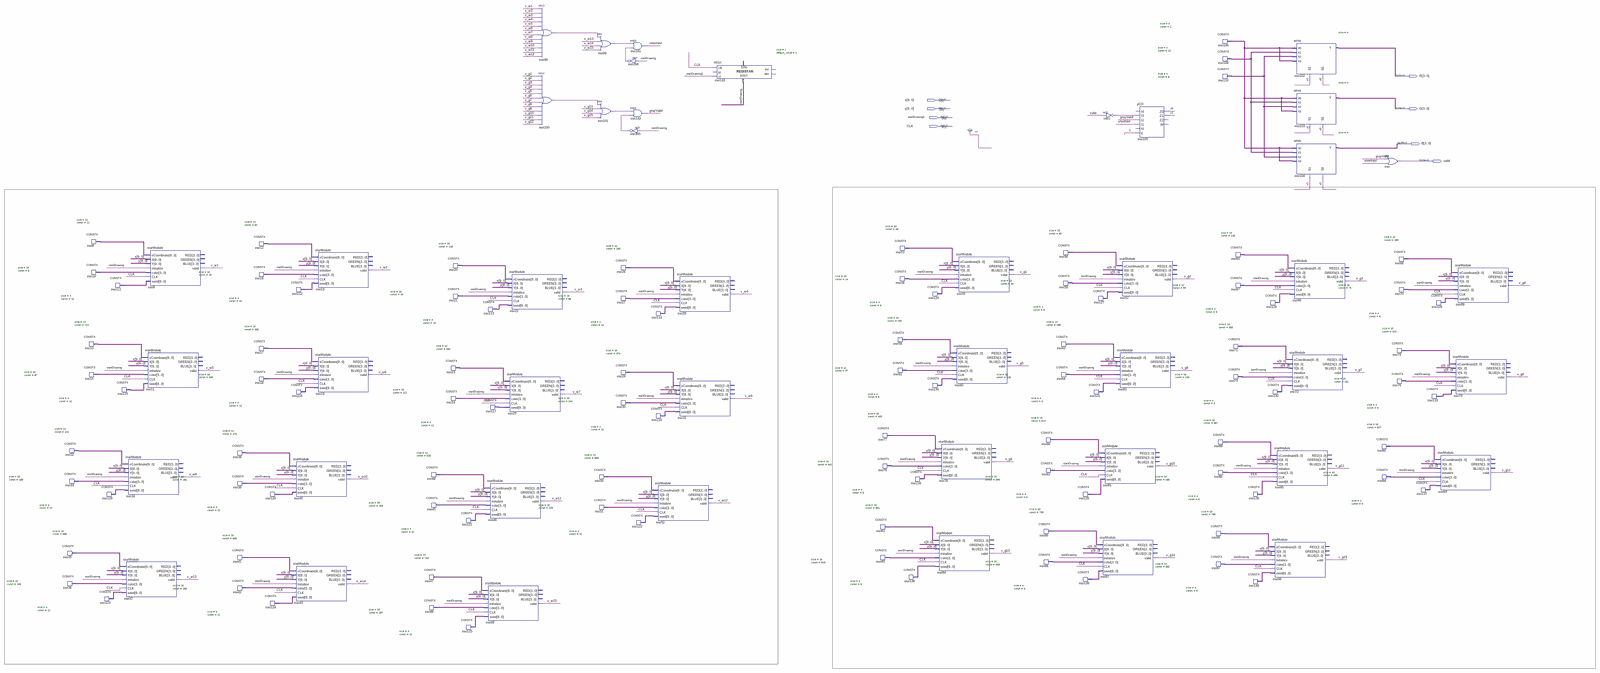
[diagram p0: schematic sheet, whole]
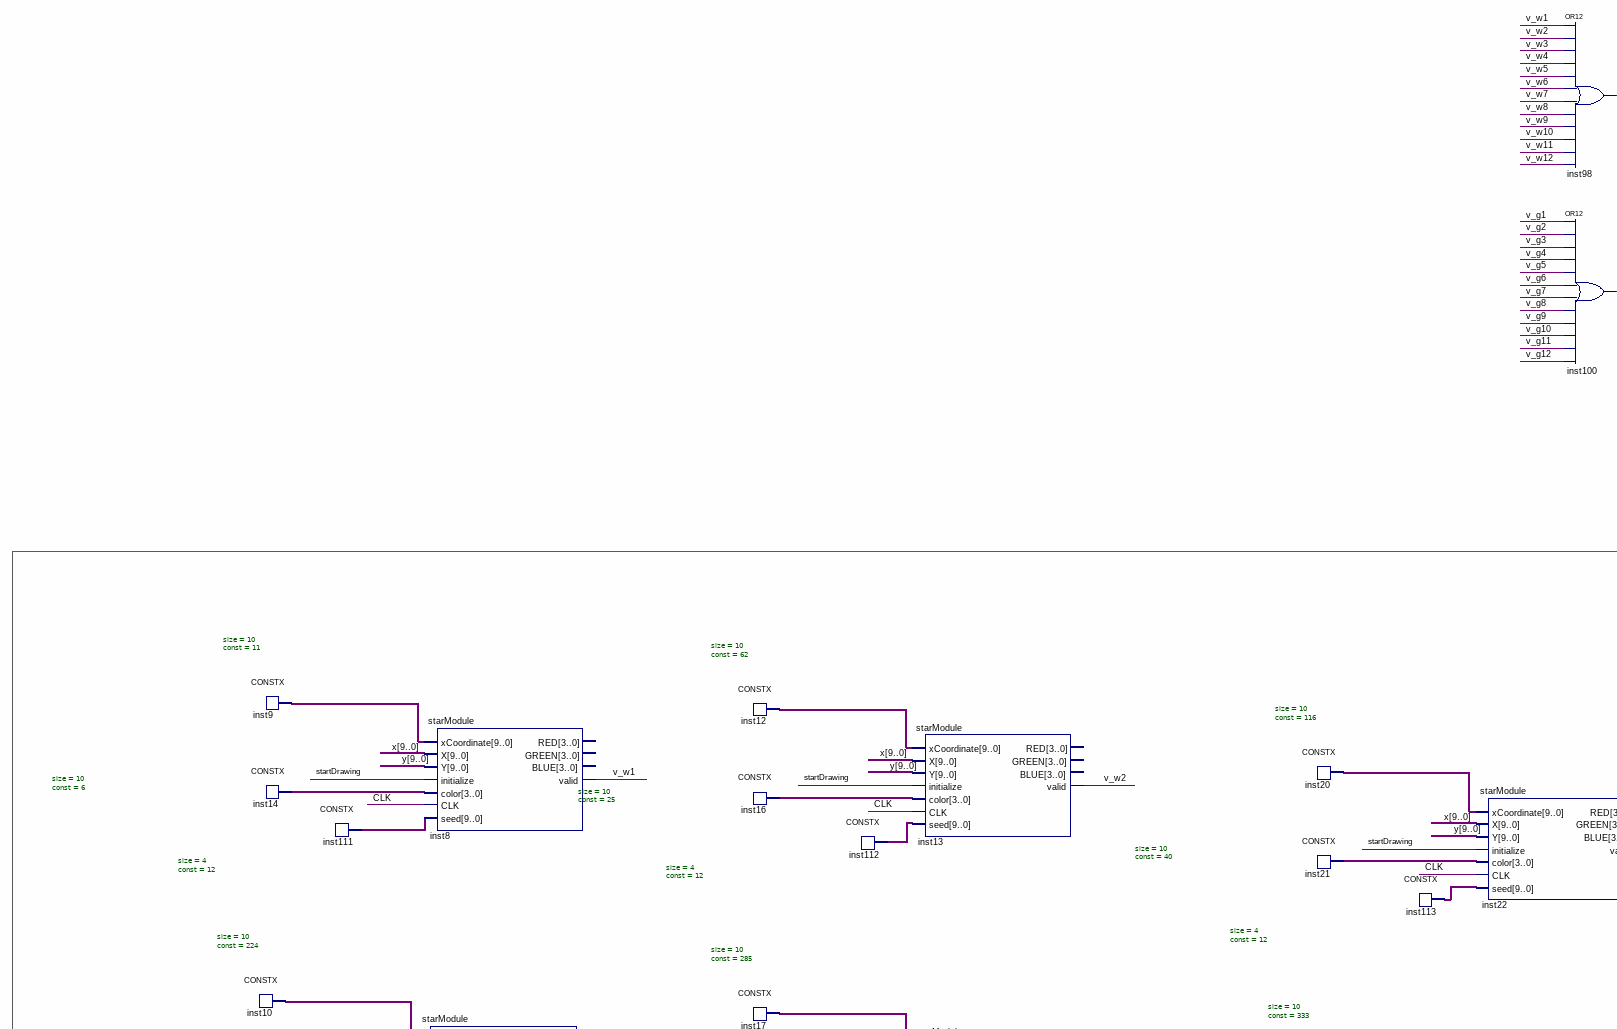
[diagram p1: schematic sheet, upper left part]
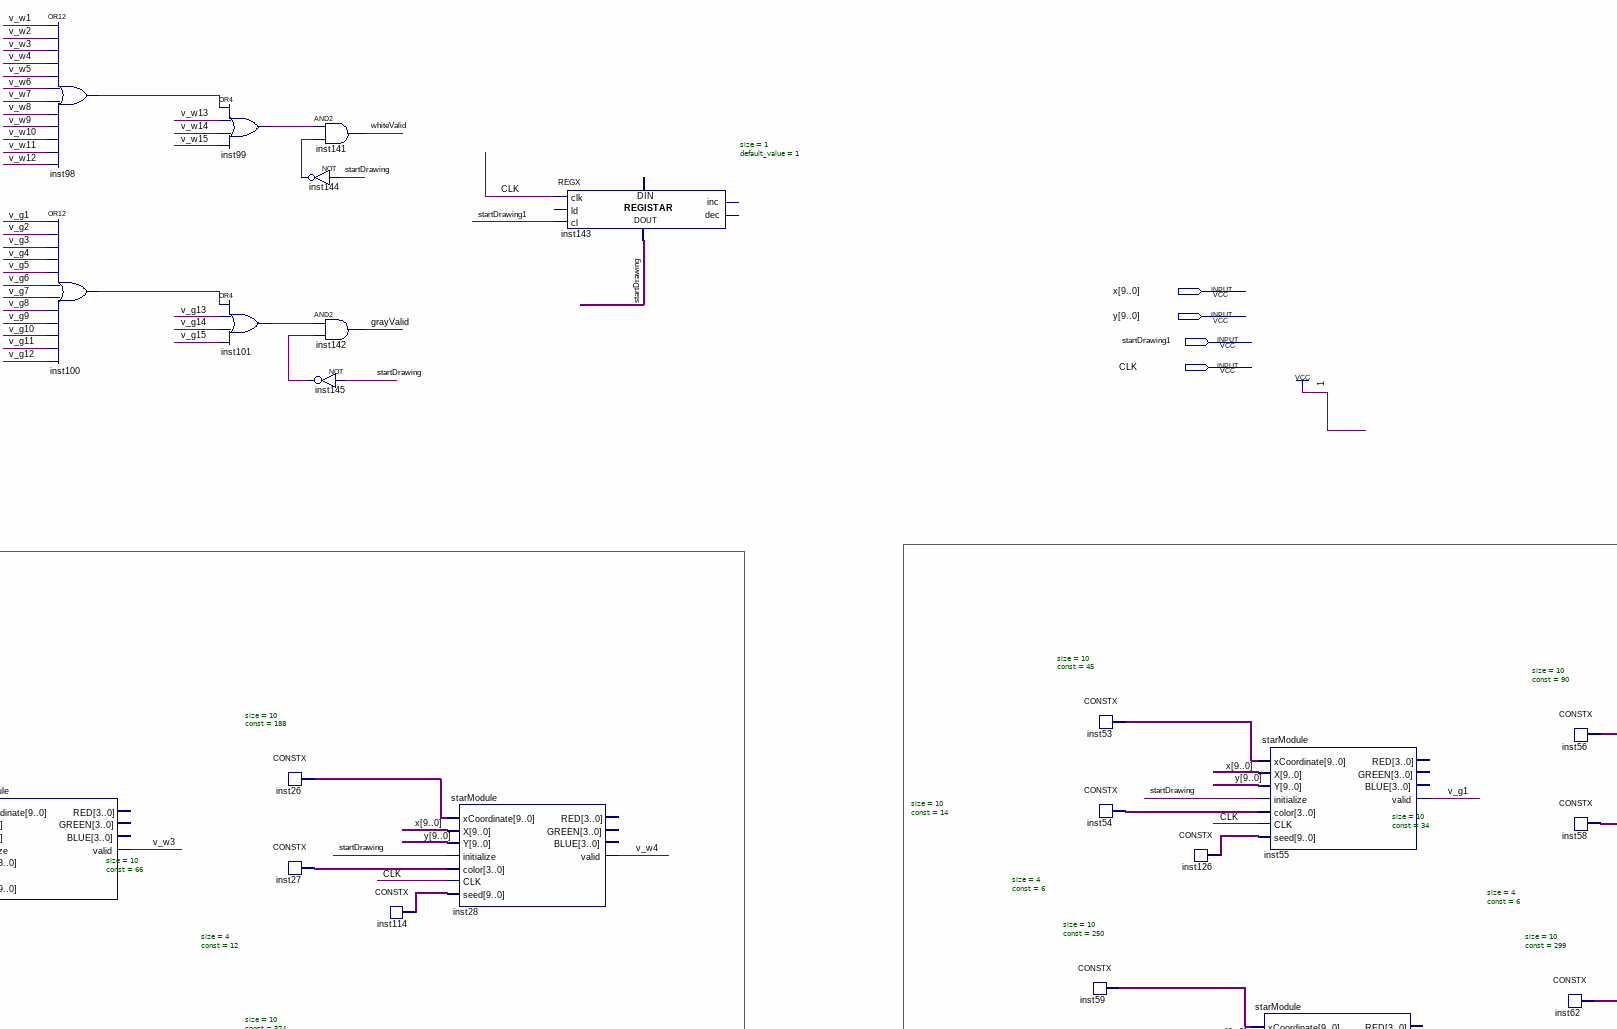
[diagram p2: schematic sheet, upper centre part]
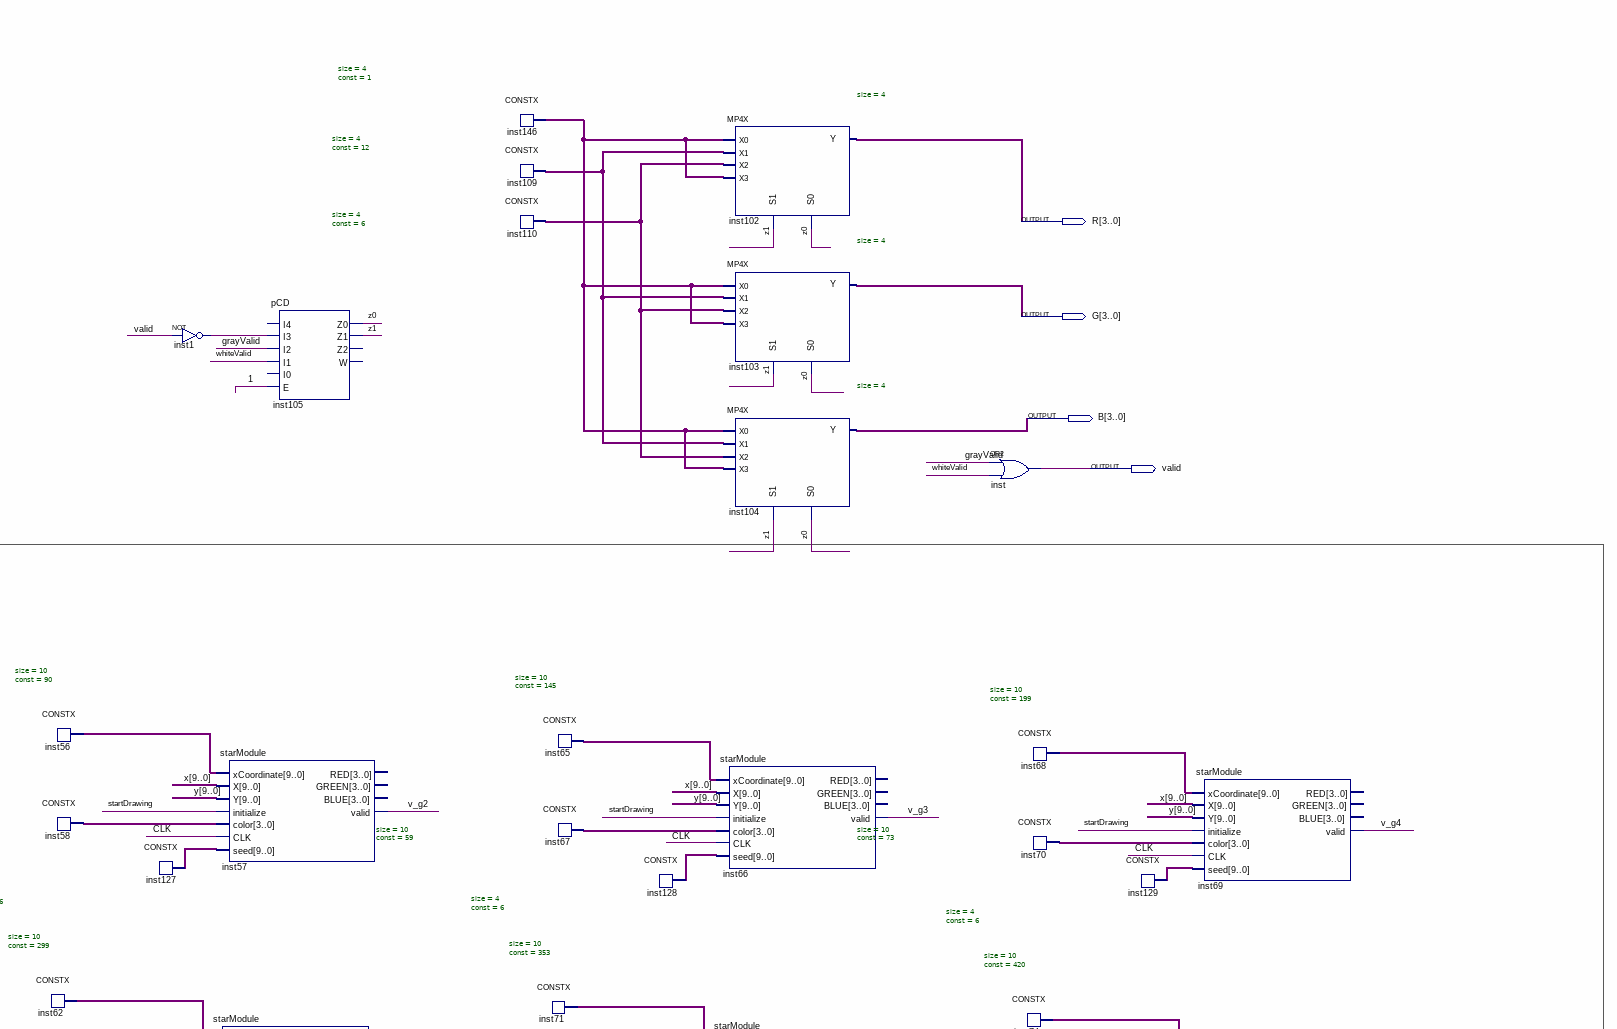
[diagram p3: schematic sheet, upper right part]
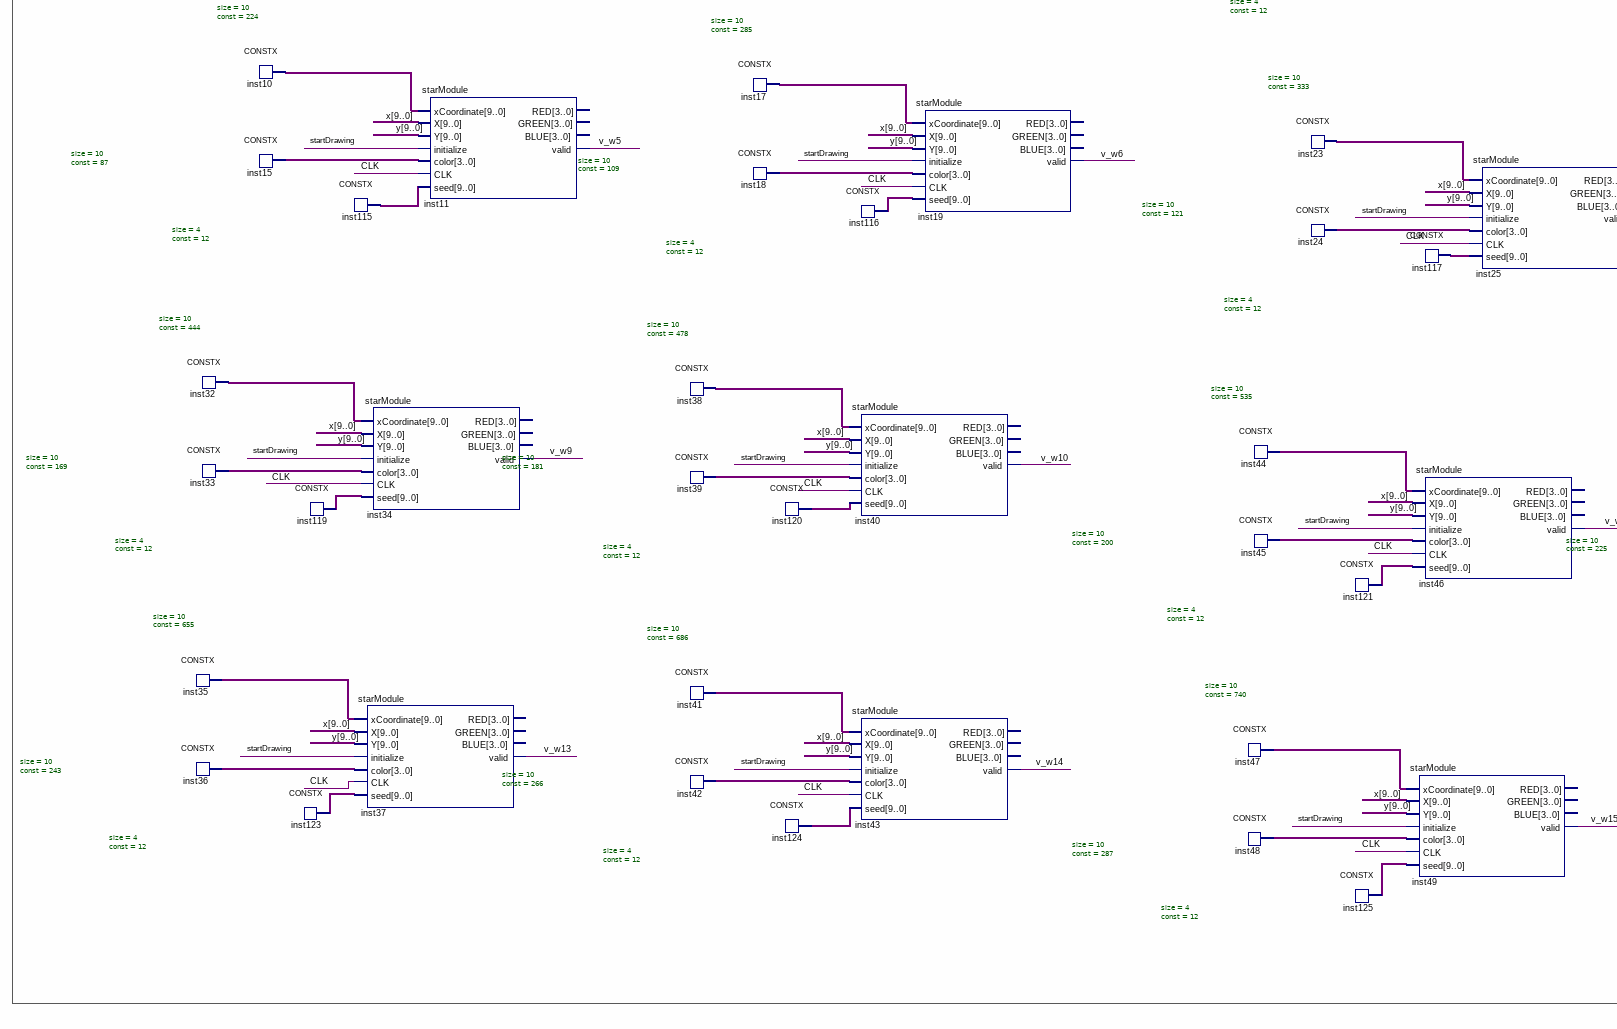
[diagram p4: schematic sheet, lower left part]
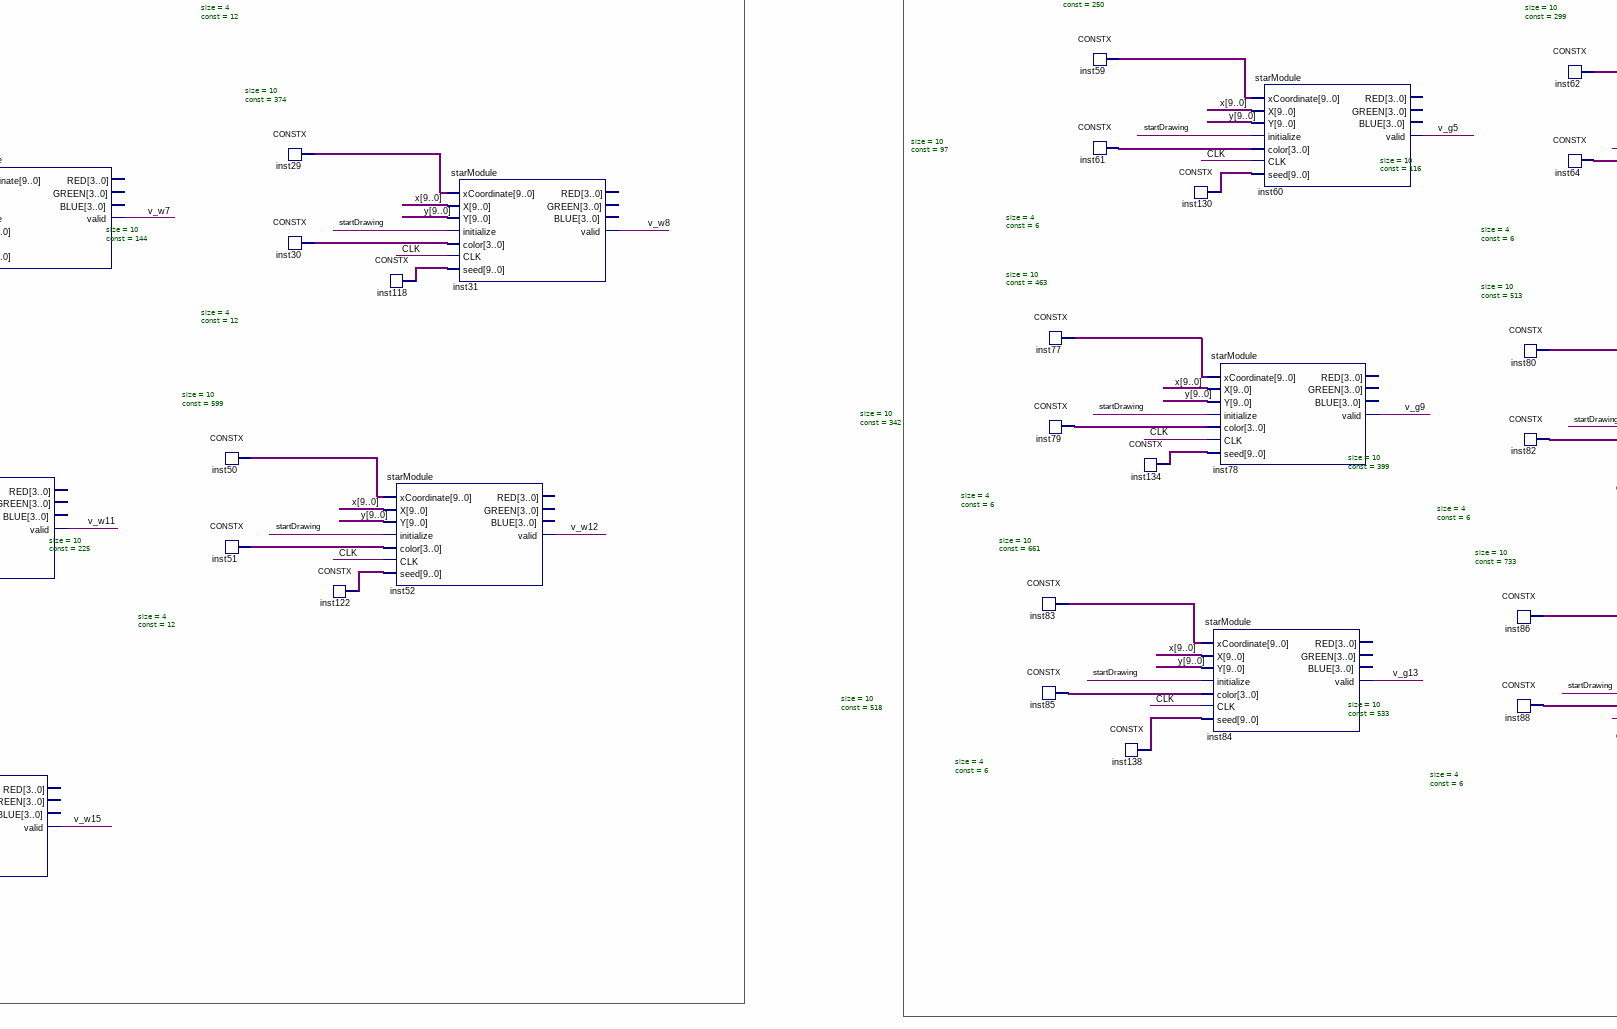
[diagram p5: schematic sheet, lower centre part]
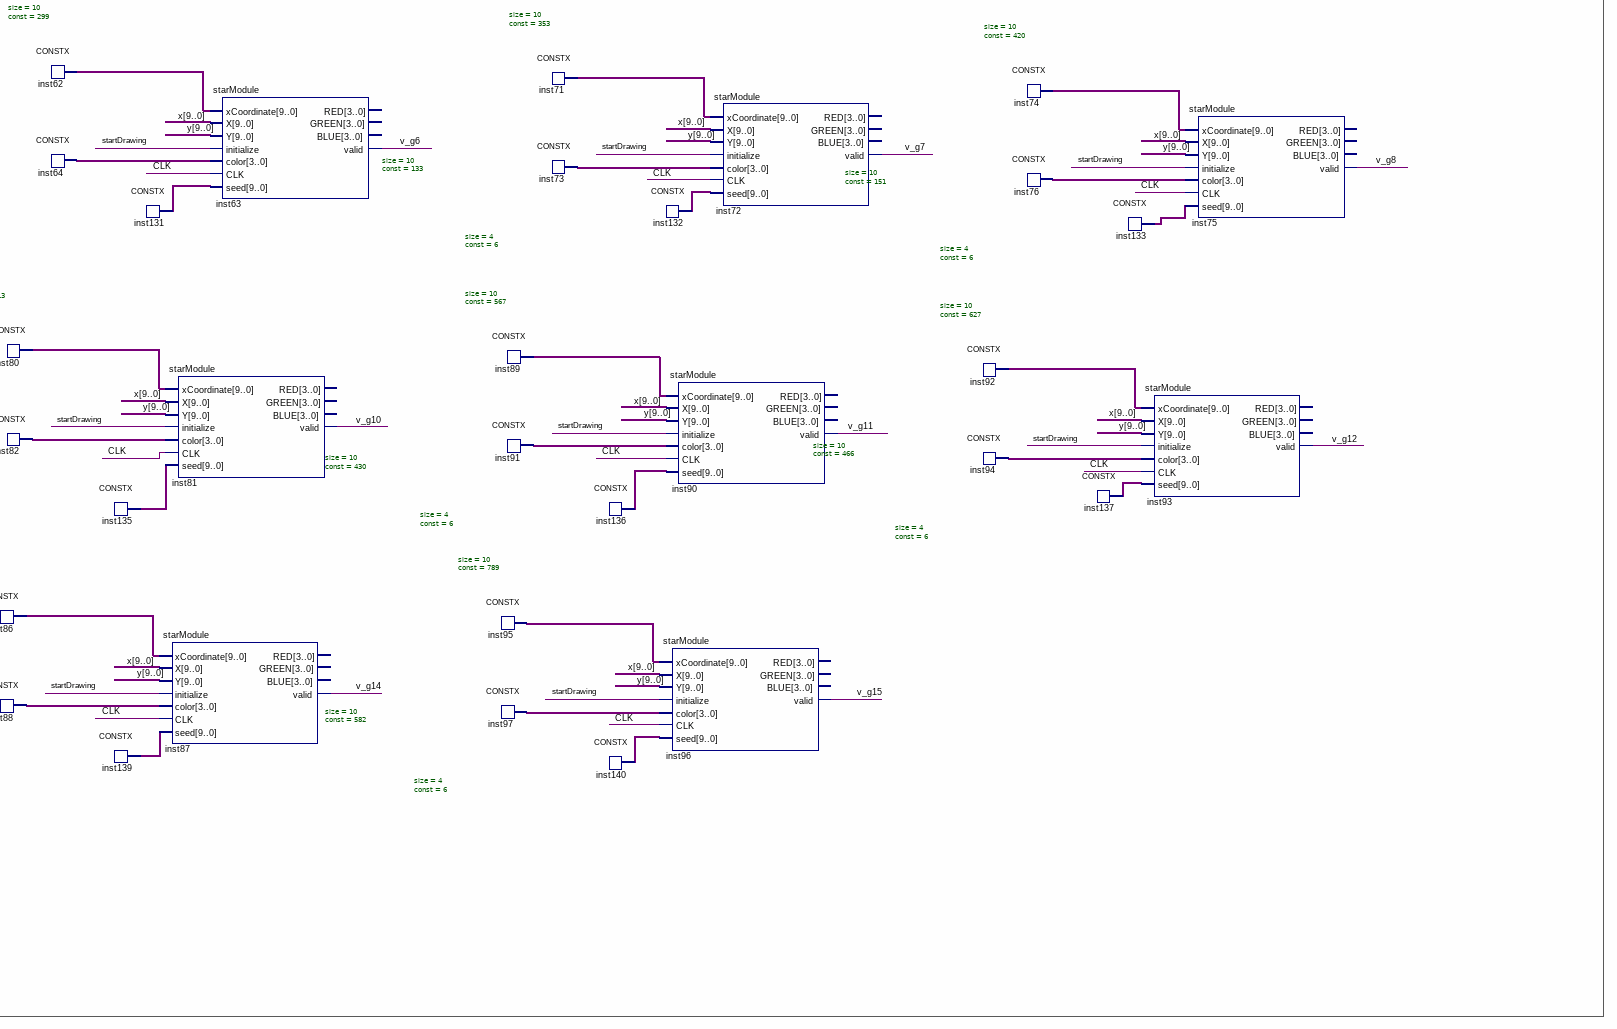
[diagram p6: schematic sheet, lower right part]
// Quartus schematic map.bdf as structural Verilog: 138 symbols, 8 pins
module map (
  input  [9:0] x,
  input  [9:0] y,
  input  startDrawing1,
  input  CLK,
  output [3:0] R,
  output [3:0] G,
  output [3:0] B,
  output valid
);

  wire grayValid, inst1_out, inst98_out, inst99_out, inst100_out, inst101_out, inst144_out, inst145_out,
       startDrawing, v_g1, v_g2, v_g3, v_g4, v_g5, v_g6, v_g7, v_g8, v_g9, v_g10, v_g11, v_g12, v_g13, v_g14,
       v_g15, v_w1, v_w2, v_w3, v_w4, v_w5, v_w6, v_w7, v_w8, v_w9, v_w10, v_w11, v_w12, v_w13, v_w14, v_w15,
       whiteValid, z0, z1;
  wire [3:0] inst14_data, inst15_data, inst16_data, inst18_data, inst21_data, inst24_data, inst27_data,
       inst30_data, inst33_data, inst36_data, inst39_data, inst42_data, inst45_data, inst48_data,
       inst51_data, inst54_data, inst58_data, inst61_data, inst64_data, inst67_data, inst70_data,
       inst73_data, inst76_data, inst79_data, inst82_data, inst85_data, inst88_data, inst91_data,
       inst94_data, inst97_data, inst109_data, inst110_data, inst146_data;
  wire [9:0] inst9_data, inst10_data, inst12_data, inst17_data, inst20_data, inst23_data, inst26_data,
       inst29_data, inst32_data, inst35_data, inst38_data, inst41_data, inst44_data, inst47_data,
       inst50_data, inst53_data, inst56_data, inst59_data, inst62_data, inst65_data, inst68_data,
       inst71_data, inst74_data, inst77_data, inst80_data, inst83_data, inst86_data, inst89_data,
       inst92_data, inst95_data, inst111_data, inst112_data, inst113_data, inst114_data, inst115_data,
       inst116_data, inst117_data, inst118_data, inst119_data, inst120_data, inst121_data, inst122_data,
       inst123_data, inst124_data, inst125_data, inst126_data, inst127_data, inst128_data, inst129_data,
       inst130_data, inst131_data, inst132_data, inst133_data, inst134_data, inst135_data, inst136_data,
       inst137_data, inst138_data, inst139_data, inst140_data;

  CONSTX #(.size(10), .\const (444)) inst32 (.data(inst32_data));
  CONSTX #(.size(4), .\const (12)) inst33 (.data(inst33_data));
  CONSTX #(.size(10), .\const (655)) inst35 (.data(inst35_data));
  CONSTX #(.size(4), .\const (12)) inst36 (.data(inst36_data));
  CONSTX #(.size(10), .\const (11)) inst9 (.data(inst9_data));
  CONSTX #(.size(4), .\const (12)) inst14 (.data(inst14_data));
  CONSTX #(.size(10), .\const (224)) inst10 (.data(inst10_data));
  CONSTX #(.size(4), .\const (12)) inst15 (.data(inst15_data));
  CONSTX #(.size(10), .\const (243)) inst123 (.data(inst123_data));
  CONSTX #(.size(10), .\const (6)) inst111 (.data(inst111_data));
  CONSTX #(.size(10), .\const (87)) inst115 (.data(inst115_data));
  CONSTX #(.size(10), .\const (169)) inst119 (.data(inst119_data));
  starModule inst34 (
    .xCoordinate(inst32_data), .X(x), .Y(y), .initialize(startDrawing), .color(inst33_data), .CLK(CLK),
    .seed(inst119_data), .valid(v_w9));  // open: RED, GREEN, BLUE
  starModule inst37 (
    .xCoordinate(inst35_data), .X(x), .Y(y), .initialize(startDrawing), .color(inst36_data), .CLK(CLK),
    .seed(inst123_data), .valid(v_w13));  // open: RED, GREEN, BLUE
  starModule inst8 (
    .xCoordinate(inst9_data), .X(x), .Y(y), .initialize(startDrawing), .color(inst14_data), .CLK(CLK),
    .seed(inst111_data), .valid(v_w1));  // open: RED, GREEN, BLUE
  starModule inst11 (
    .xCoordinate(inst10_data), .X(x), .Y(y), .initialize(startDrawing), .color(inst15_data), .CLK(CLK),
    .seed(inst115_data), .valid(v_w5));  // open: RED, GREEN, BLUE
  CONSTX #(.size(10), .\const (478)) inst38 (.data(inst38_data));
  CONSTX #(.size(4), .\const (12)) inst39 (.data(inst39_data));
  CONSTX #(.size(10), .\const (686)) inst41 (.data(inst41_data));
  CONSTX #(.size(4), .\const (12)) inst42 (.data(inst42_data));
  CONSTX #(.size(10), .\const (62)) inst12 (.data(inst12_data));
  CONSTX #(.size(4), .\const (12)) inst16 (.data(inst16_data));
  CONSTX #(.size(10), .\const (285)) inst17 (.data(inst17_data));
  CONSTX #(.size(4), .\const (12)) inst18 (.data(inst18_data));
  CONSTX #(.size(10), .\const (181)) inst120 (.data(inst120_data));
  CONSTX #(.size(10), .\const (266)) inst124 (.data(inst124_data));
  CONSTX #(.size(10), .\const (25)) inst112 (.data(inst112_data));
  CONSTX #(.size(10), .\const (109)) inst116 (.data(inst116_data));
  starModule inst40 (
    .xCoordinate(inst38_data), .X(x), .Y(y), .initialize(startDrawing), .color(inst39_data), .CLK(CLK),
    .seed(inst120_data), .valid(v_w10));  // open: RED, GREEN, BLUE
  starModule inst43 (
    .xCoordinate(inst41_data), .X(x), .Y(y), .initialize(startDrawing), .color(inst42_data), .CLK(CLK),
    .seed(inst124_data), .valid(v_w14));  // open: RED, GREEN, BLUE
  starModule inst13 (
    .xCoordinate(inst12_data), .X(x), .Y(y), .initialize(startDrawing), .color(inst16_data), .CLK(CLK),
    .seed(inst112_data), .valid(v_w2));  // open: RED, GREEN, BLUE
  starModule inst19 (
    .xCoordinate(inst17_data), .X(x), .Y(y), .initialize(startDrawing), .color(inst18_data), .CLK(CLK),
    .seed(inst116_data), .valid(v_w6));  // open: RED, GREEN, BLUE
  CONSTX #(.size(10), .\const (535)) inst44 (.data(inst44_data));
  CONSTX #(.size(4), .\const (12)) inst45 (.data(inst45_data));
  CONSTX #(.size(10), .\const (740)) inst47 (.data(inst47_data));
  CONSTX #(.size(4), .\const (12)) inst48 (.data(inst48_data));
  CONSTX #(.size(10), .\const (116)) inst20 (.data(inst20_data));
  CONSTX #(.size(4), .\const (12)) inst21 (.data(inst21_data));
  CONSTX #(.size(10), .\const (333)) inst23 (.data(inst23_data));
  CONSTX #(.size(4), .\const (12)) inst24 (.data(inst24_data));
  CONSTX #(.size(10), .\const (200)) inst121 (.data(inst121_data));
  CONSTX #(.size(10), .\const (287)) inst125 (.data(inst125_data));
  CONSTX #(.size(10), .\const (40)) inst113 (.data(inst113_data));
  CONSTX #(.size(10), .\const (121)) inst117 (.data(inst117_data));
  starModule inst46 (
    .xCoordinate(inst44_data), .X(x), .Y(y), .initialize(startDrawing), .color(inst45_data), .CLK(CLK),
    .seed(inst121_data), .valid(v_w11));  // open: RED, GREEN, BLUE
  starModule inst49 (
    .xCoordinate(inst47_data), .X(x), .Y(y), .initialize(startDrawing), .color(inst48_data), .CLK(CLK),
    .seed(inst125_data), .valid(v_w15));  // open: RED, GREEN, BLUE
  starModule inst22 (
    .xCoordinate(inst20_data), .X(x), .Y(y), .initialize(startDrawing), .color(inst21_data), .CLK(CLK),
    .seed(inst113_data), .valid(v_w3));  // open: RED, GREEN, BLUE
  starModule inst25 (
    .xCoordinate(inst23_data), .X(x), .Y(y), .initialize(startDrawing), .color(inst24_data), .CLK(CLK),
    .seed(inst117_data), .valid(v_w7));  // open: RED, GREEN, BLUE
  or inst98 (inst98_out, v_w1, v_w2, v_w3, v_w4, v_w5, v_w6, v_w7, v_w8, v_w9, v_w10, v_w11, v_w12);
  or inst100 (inst100_out, v_g1, v_g2, v_g3, v_g4, v_g5, v_g6, v_g7, v_g8, v_g9, v_g10, v_g11, v_g12);
  or inst99 (inst99_out, inst98_out, v_w13, v_w14, v_w15);
  or inst101 (inst101_out, inst100_out, v_g13, v_g14, v_g15);
  CONSTX #(.size(10), .\const (599)) inst50 (.data(inst50_data));
  CONSTX #(.size(4), .\const (12)) inst51 (.data(inst51_data));
  CONSTX #(.size(10), .\const (188)) inst26 (.data(inst26_data));
  CONSTX #(.size(4), .\const (12)) inst27 (.data(inst27_data));
  CONSTX #(.size(10), .\const (374)) inst29 (.data(inst29_data));
  CONSTX #(.size(4), .\const (12)) inst30 (.data(inst30_data));
  and inst141 (whiteValid, inst99_out, inst144_out);
  not inst144 (inst144_out, startDrawing);
  and inst142 (grayValid, inst101_out, inst145_out);
  not inst145 (inst145_out, startDrawing);
  CONSTX #(.size(10), .\const (225)) inst122 (.data(inst122_data));
  CONSTX #(.size(10), .\const (66)) inst114 (.data(inst114_data));
  CONSTX #(.size(10), .\const (144)) inst118 (.data(inst118_data));
  starModule inst52 (
    .xCoordinate(inst50_data), .X(x), .Y(y), .initialize(startDrawing), .color(inst51_data), .CLK(CLK),
    .seed(inst122_data), .valid(v_w12));  // open: RED, GREEN, BLUE
  starModule inst28 (
    .xCoordinate(inst26_data), .X(x), .Y(y), .initialize(startDrawing), .color(inst27_data), .CLK(CLK),
    .seed(inst114_data), .valid(v_w4));  // open: RED, GREEN, BLUE
  starModule inst31 (
    .xCoordinate(inst29_data), .X(x), .Y(y), .initialize(startDrawing), .color(inst30_data), .CLK(CLK),
    .seed(inst118_data), .valid(v_w8));  // open: RED, GREEN, BLUE
  REGX #(.size(1), .default_value(1)) inst143 (
    .clk(CLK), .cl(startDrawing1), .data_out(startDrawing));  // open: ld, inc, dec, data_in
  CONSTX #(.size(10), .\const (463)) inst77 (.data(inst77_data));
  CONSTX #(.size(4), .\const (6)) inst79 (.data(inst79_data));
  CONSTX #(.size(10), .\const (661)) inst83 (.data(inst83_data));
  CONSTX #(.size(4), .\const (6)) inst85 (.data(inst85_data));
  CONSTX #(.size(10), .\const (45)) inst53 (.data(inst53_data));
  CONSTX #(.size(4), .\const (6)) inst54 (.data(inst54_data));
  CONSTX #(.size(10), .\const (250)) inst59 (.data(inst59_data));
  CONSTX #(.size(4), .\const (6)) inst61 (.data(inst61_data));
  CONSTX #(.size(10), .\const (342)) inst134 (.data(inst134_data));
  CONSTX #(.size(10), .\const (518)) inst138 (.data(inst138_data));
  CONSTX #(.size(10), .\const (14)) inst126 (.data(inst126_data));
  CONSTX #(.size(10), .\const (97)) inst130 (.data(inst130_data));
  starModule inst84 (
    .xCoordinate(inst83_data), .X(x), .Y(y), .initialize(startDrawing), .color(inst85_data), .CLK(CLK),
    .seed(inst138_data), .valid(v_g13));  // open: RED, GREEN, BLUE
  starModule inst60 (
    .xCoordinate(inst59_data), .X(x), .Y(y), .initialize(startDrawing), .color(inst61_data), .CLK(CLK),
    .seed(inst130_data), .valid(v_g5));  // open: RED, GREEN, BLUE
  starModule inst78 (
    .xCoordinate(inst77_data), .X(x), .Y(y), .initialize(startDrawing), .color(inst79_data), .CLK(CLK),
    .seed(inst134_data), .valid(v_g9));  // open: RED, GREEN, BLUE
  starModule inst55 (
    .xCoordinate(inst53_data), .X(x), .Y(y), .initialize(startDrawing), .color(inst54_data), .CLK(CLK),
    .seed(inst126_data), .valid(v_g1));  // open: RED, GREEN, BLUE
  CONSTX #(.size(10), .\const (513)) inst80 (.data(inst80_data));
  CONSTX #(.size(4), .\const (6)) inst82 (.data(inst82_data));
  CONSTX #(.size(10), .\const (733)) inst86 (.data(inst86_data));
  CONSTX #(.size(4), .\const (6)) inst88 (.data(inst88_data));
  CONSTX #(.size(10), .\const (90)) inst56 (.data(inst56_data));
  CONSTX #(.size(4), .\const (6)) inst58 (.data(inst58_data));
  CONSTX #(.size(10), .\const (299)) inst62 (.data(inst62_data));
  CONSTX #(.size(4), .\const (6)) inst64 (.data(inst64_data));
  CONSTX #(.size(10), .\const (34)) inst127 (.data(inst127_data));
  CONSTX #(.size(10), .\const (116)) inst131 (.data(inst131_data));
  CONSTX #(.size(10), .\const (399)) inst135 (.data(inst135_data));
  CONSTX #(.size(10), .\const (533)) inst139 (.data(inst139_data));
  not inst1 (inst1_out, valid);
  starModule inst81 (
    .xCoordinate(inst80_data), .X(x), .Y(y), .initialize(startDrawing), .color(inst82_data), .CLK(CLK),
    .seed(inst135_data), .valid(v_g10));  // open: RED, GREEN, BLUE
  starModule inst87 (
    .xCoordinate(inst86_data), .X(x), .Y(y), .initialize(startDrawing), .color(inst88_data), .CLK(CLK),
    .seed(inst139_data), .valid(v_g14));  // open: RED, GREEN, BLUE
  starModule inst57 (
    .xCoordinate(inst56_data), .X(x), .Y(y), .initialize(startDrawing), .color(inst58_data), .CLK(CLK),
    .seed(inst127_data), .valid(v_g2));  // open: RED, GREEN, BLUE
  starModule inst63 (
    .xCoordinate(inst62_data), .X(x), .Y(y), .initialize(startDrawing), .color(inst64_data), .CLK(CLK),
    .seed(inst131_data), .valid(v_g6));  // open: RED, GREEN, BLUE
  pCD inst105 (.I3(inst1_out), .I2(grayValid), .I1(whiteValid), .E(1'b1), .Z0(z0), .Z1(z1));  // open: I4, I0, Z2, W
  CONSTX #(.size(10), .\const (567)) inst89 (.data(inst89_data));
  CONSTX #(.size(4), .\const (6)) inst91 (.data(inst91_data));
  CONSTX #(.size(10), .\const (789)) inst95 (.data(inst95_data));
  CONSTX #(.size(4), .\const (6)) inst97 (.data(inst97_data));
  CONSTX #(.size(4), .\const (1)) inst146 (.data(inst146_data));
  CONSTX #(.size(4), .\const (12)) inst109 (.data(inst109_data));
  CONSTX #(.size(4), .\const (6)) inst110 (.data(inst110_data));
  CONSTX #(.size(10), .\const (145)) inst65 (.data(inst65_data));
  CONSTX #(.size(4), .\const (6)) inst67 (.data(inst67_data));
  CONSTX #(.size(10), .\const (353)) inst71 (.data(inst71_data));
  CONSTX #(.size(4), .\const (6)) inst73 (.data(inst73_data));
  CONSTX #(.size(10), .\const (430)) inst136 (.data(inst136_data));
  CONSTX #(.size(10), .\const (582)) inst140 (.data(inst140_data));
  CONSTX #(.size(10), .\const (59)) inst128 (.data(inst128_data));
  CONSTX #(.size(10), .\const (133)) inst132 (.data(inst132_data));
  starModule inst90 (
    .xCoordinate(inst89_data), .X(x), .Y(y), .initialize(startDrawing), .color(inst91_data), .CLK(CLK),
    .seed(inst136_data), .valid(v_g11));  // open: RED, GREEN, BLUE
  starModule inst96 (
    .xCoordinate(inst95_data), .X(x), .Y(y), .initialize(startDrawing), .color(inst97_data), .CLK(CLK),
    .seed(inst140_data), .valid(v_g15));  // open: RED, GREEN, BLUE
  MP4X #(.size(4)) inst102 (
    .X0(inst146_data), .X1(inst109_data), .X2(inst110_data), .X3(inst146_data), .S1(z1), .S0(z0), .Y(R));
  MP4X #(.size(4)) inst103 (
    .X0(inst146_data), .X1(inst109_data), .X2(inst110_data), .X3(inst146_data), .S1(z1), .S0(z0), .Y(G));
  MP4X #(.size(4)) inst104 (
    .X0(inst146_data), .X1(inst109_data), .X2(inst110_data), .X3(inst146_data), .S1(z1), .S0(z0), .Y(B));
  starModule inst66 (
    .xCoordinate(inst65_data), .X(x), .Y(y), .initialize(startDrawing), .color(inst67_data), .CLK(CLK),
    .seed(inst128_data), .valid(v_g3));  // open: RED, GREEN, BLUE
  starModule inst72 (
    .xCoordinate(inst71_data), .X(x), .Y(y), .initialize(startDrawing), .color(inst73_data), .CLK(CLK),
    .seed(inst132_data), .valid(v_g7));  // open: RED, GREEN, BLUE
  or inst (valid, grayValid, whiteValid);
  CONSTX #(.size(10), .\const (627)) inst92 (.data(inst92_data));
  CONSTX #(.size(4), .\const (6)) inst94 (.data(inst94_data));
  CONSTX #(.size(10), .\const (199)) inst68 (.data(inst68_data));
  CONSTX #(.size(4), .\const (6)) inst70 (.data(inst70_data));
  CONSTX #(.size(10), .\const (420)) inst74 (.data(inst74_data));
  CONSTX #(.size(4), .\const (6)) inst76 (.data(inst76_data));
  CONSTX #(.size(10), .\const (466)) inst137 (.data(inst137_data));
  CONSTX #(.size(10), .\const (73)) inst129 (.data(inst129_data));
  CONSTX #(.size(10), .\const (151)) inst133 (.data(inst133_data));
  starModule inst93 (
    .xCoordinate(inst92_data), .X(x), .Y(y), .initialize(startDrawing), .color(inst94_data), .CLK(CLK),
    .seed(inst137_data), .valid(v_g12));  // open: RED, GREEN, BLUE
  starModule inst69 (
    .xCoordinate(inst68_data), .X(x), .Y(y), .initialize(startDrawing), .color(inst70_data), .CLK(CLK),
    .seed(inst129_data), .valid(v_g4));  // open: RED, GREEN, BLUE
  starModule inst75 (
    .xCoordinate(inst74_data), .X(x), .Y(y), .initialize(startDrawing), .color(inst76_data), .CLK(CLK),
    .seed(inst133_data), .valid(v_g8));  // open: RED, GREEN, BLUE
endmodule
